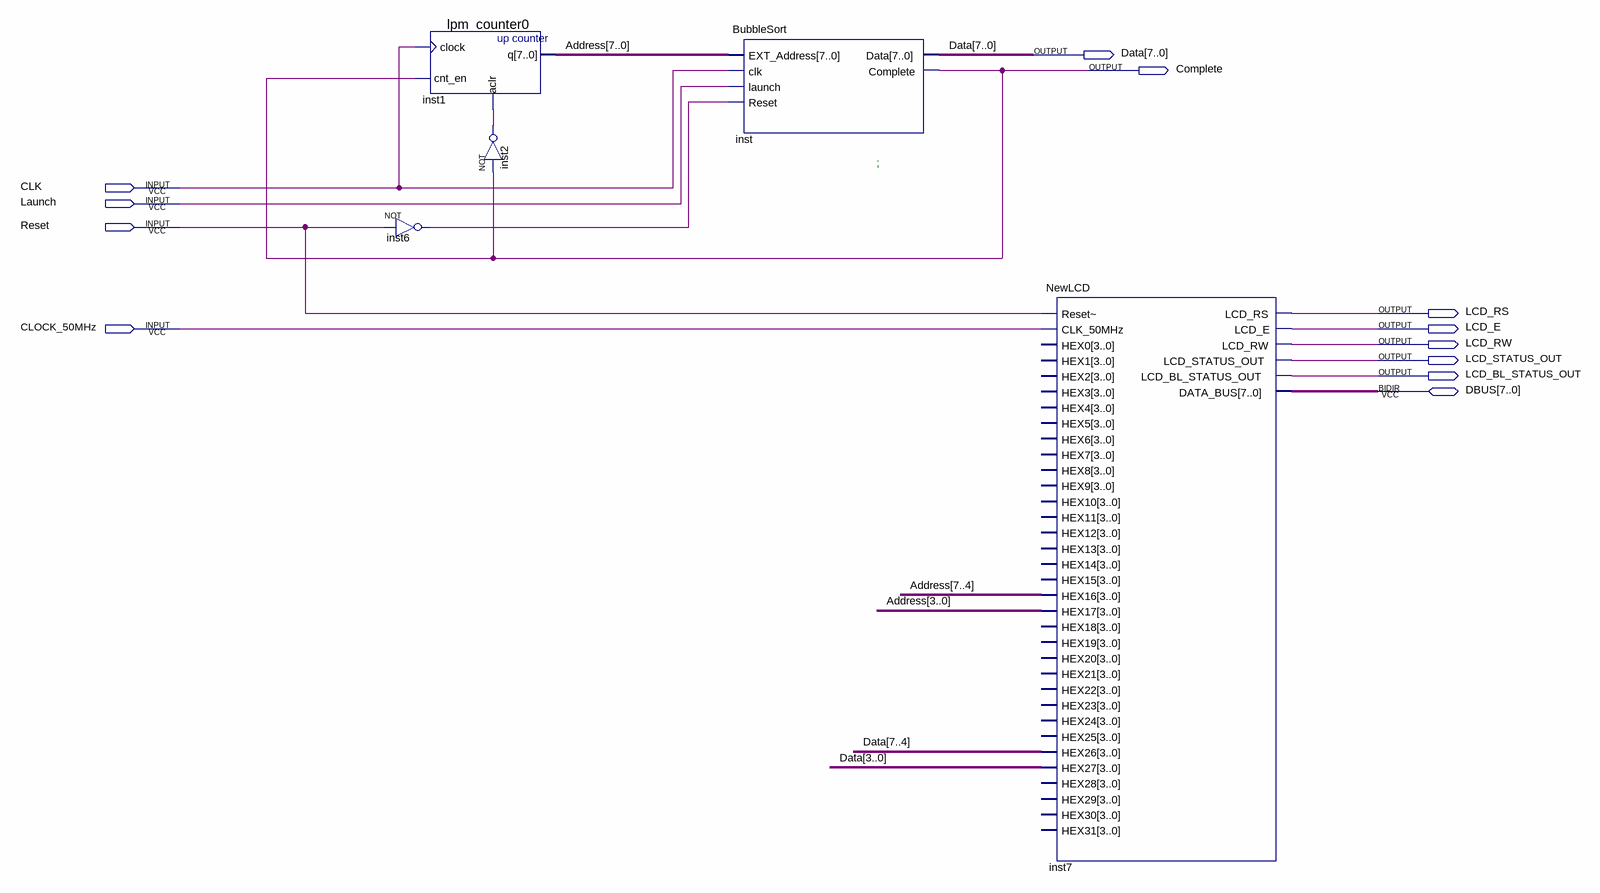
[diagram p0: schematic sheet]
// Quartus schematic SortSystem.bdf as structural Verilog: 5 symbols, 12 pins
module SortSystem (
  input  CLK,
  input  Launch,
  input  Reset,
  input  CLOCK_50MHz,
  inout  [7:0] DBUS,
  output [7:0] Data,
  output Complete,
  output LCD_RS,
  output LCD_E,
  output LCD_RW,
  output LCD_STATUS_OUT,
  output LCD_BL_STATUS_OUT
);

  wire inst2_out, inst6_out;
  wire [7:0] Address;

  not inst6 (inst6_out, Reset);
  lpm_counter0 inst1 (.clock(CLK), .cnt_en(Complete), .aclr(inst2_out), .q(Address));
  not inst2 (inst2_out, Complete);
  BubbleSort inst (
    .EXT_Address(Address), .clk(CLK), .launch(Launch), .Reset(inst6_out), .Data(Data), .Complete(Complete));
  NewLCD inst7 (
    .\Reset~ (Reset), .CLK_50MHz(CLOCK_50MHz), .HEX16(Address[7:4]), .HEX17(Address[3:0]), .HEX26(Data[7:4]),
    .HEX27(Data[3:0]), .LCD_RS(LCD_RS), .LCD_E(LCD_E), .LCD_RW(LCD_RW), .LCD_STATUS_OUT(LCD_STATUS_OUT),
    .LCD_BL_STATUS_OUT(LCD_BL_STATUS_OUT), .DATA_BUS(DBUS));  // open: HEX0, HEX1, HEX2, HEX3, HEX4, HEX5, HEX6, HEX7, HEX8, HEX9, HEX10, HEX11, HEX12, HEX13, HEX14, HEX15, HEX18, HEX19, HEX20, HEX21, HEX22, HEX23, HEX24, HEX25, HEX28, HEX29, HEX30, HEX31

  // Notes on the sheet:
  //   ;
endmodule
